# Altium schematic sheet 暂停.SchDoc
size A4
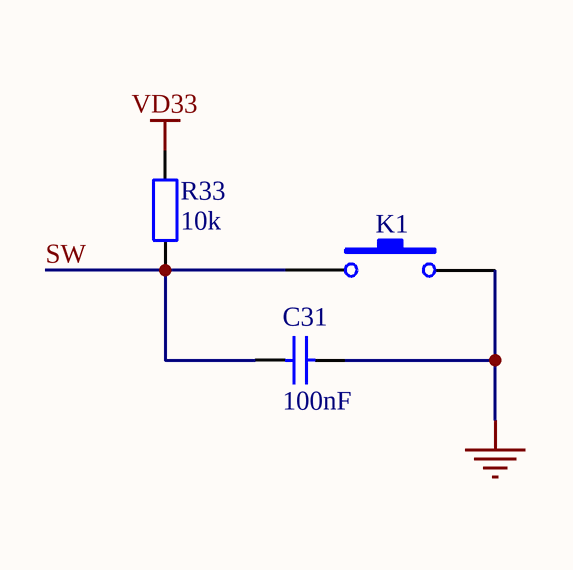
[diagram p0: 暂停.SchDoc]

## Parts
C31  100nF  [LC-0805_C]
K1  �ᴥ����  [SW6X6]  (value not drawn)
R33  10k  [LC-0805_R]

## Nets
NetC31_2: C31.2 K1.2
VD33: R33.2
SW: C31.1 K1.1 R33.1

## Library data of the parts
C31 = Cap: 100nF��0805��50V,+/-10%
K1 = SW-PB: �ᴥ����6��6mm,�Ľǲ��; Published: 24-Mar-1999; LatestRevisionDate: 17-Jul-2002; LatestRevisionNote: Re-released for DXP Platform.; PackageReference: SPST-2; Publisher: Altium Limited; PackageDescription: Switch; 2 Leads
R33 = R: 10k��,0805,��5%